# EAGLE design co2-sensor (EAGLE 9.2.2)
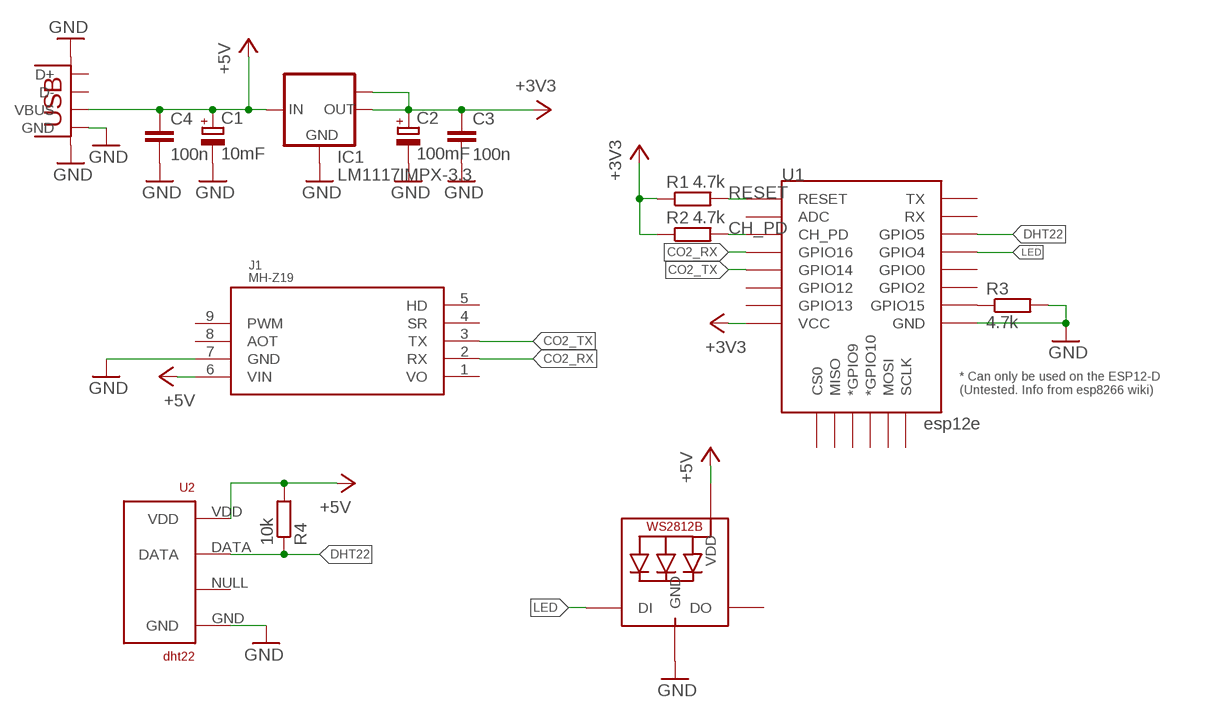
[diagram p0: schematic, sheet 1]

## Parts
C1  10mF  CPOL-EUCT3216  [CT3216]
C2  100mF  CPOL-EUCT3216  [CT3216]
C3  100n  C-EUC0805  [C0805]
C4  100n  C-EUC0805  [C0805]
IC1  LM1117IMPX-3.3  [SOT223]
J1  MH-Z19  [MH-Z19-REV]
LED1  WS2812B_5050N  [WS2812B-NARROW]
R1  4.7k  R-EU_M0805  [M0805]
R2  4.7k  R-EU_M0805  [M0805]
R3  4.7k  R-EU_M0805  [M0805]
R4  10k  R-EU_M0805  [M0805]
U1  esp12e  ESP12ESMD  [ESP12E-SMD]
U2  dht22  RHT03_DHT-22_AM2302WIRED  [AM2302]
U$1  USB-A  [USB-A-SMT]

## Nets
+3V3 [+3.3V]: C2.+ C3.1 IC1.2(OUT) IC1.TAB(OUT1) R1.1 R2.1 U1.VCC
+5V [+5V]: C1.+ C4.1 IC1.3(IN) J1.6(VIN) LED1.1-VDD(VDD) R4.2 U2.VDD U$1.P$6(VBUS)
CH_PD: R2.2 U1.CH_PD
CO2_RX: J1.2(RX) U1.GPIO16
CO2_TX: J1.3(TX) U1.GPIO14
DHT22: R4.1 U1.GPIO5 U2.DATA
GND [GND]: C1.- C2.- C3.2 C4.2 IC1.1(GND) J1.7(GND) LED1.3-GND(GND) R3.2 U1.GND U2.GND U$1.P$1(GND) U$1.P$2(GND) U$1.P$3(GND)
LED: LED1.4-DIN(DI) U1.GPIO4
N$1: R3.1 U1.GPIO15
RESET: R1.2 U1.RESET
Unconnected: J1.4(SR) J1.5(HD) J1.8(AOT) J1.9(PWM) LED1.2-DOUT(DO) U1.ADC U1.CS0 U1.GPIO0 U1.GPIO2 U1.GPIO9(*GPIO9) U1.GPIO10(*GPIO10) U1.GPIO12 U1.GPIO13 U1.MISO U1.MOSI U1.RXD0(RX) U1.SCLK U1.TXD0(TX) U2.NULL U$1.P$4(D+) U$1.P$5(D-)

## Power pins joined to a net without a drawn wire
VO: J1.1(VO)

## Library data of the parts
C1 C2 = rcl:CPOL-EU: POLARIZED CAPACITOR, European symbol; SPICEPREFIX: C
C3 C4 = rcl:C-EU: CAPACITOR, European symbol; SPICEPREFIX: C
IC1 = lm1117:LM1117IMPX-*
J1 = mh-z19:MH-Z19: MH-Z19 - CO2 NDIR SENSOR
LED1 = WS2812B:WS2812B; AVAILABILITY: Unavailable; DESCRIPTION: Intelligent Control Led Integrated Light Source Pack Of 10; MF: Worldsemi; MP: WS2812B; PACKAGE: None; PRICE: None
R1-R4 = rcl:R-EU_: RESISTOR, European symbol; SPICEPREFIX: R
U1 = esp8266modules:ESP12E: ESP12E Module
U2 = RHT03_DHT-22_AM2302:RHT03_DHT-22_AM2302: RHT03 / DHT-22 / AM2302 Packages and symbol for the RHT03 / DHT-22 relative humidity and temperature sensor. Note: The AM2302 is a wired version of the DHT-22 which typically requires less clearance and is thus provided as a separate package.; PROD_ID: SEN-10167
U$1 = usb:USB-A: USB 2.0 4Pin A Type Male Plug SMT Connector

## Net classes
0 default: width 0.4 mm, clearance 0.205 mm
1 GND: width 1 mm, clearance 0.205 mm to class 0, clearance 0.205 mm
2 +5V: width 0.8 mm, clearance 0.205 mm to class 0, clearance 0.205 mm to class 1, clearance 0.205 mm
3 +3.3V: width 0.8 mm, clearance 0.205 mm to class 0, clearance 0.205 mm to class 1, clearance 0.205 mm to class 2, clearance 0.205 mm

## Board
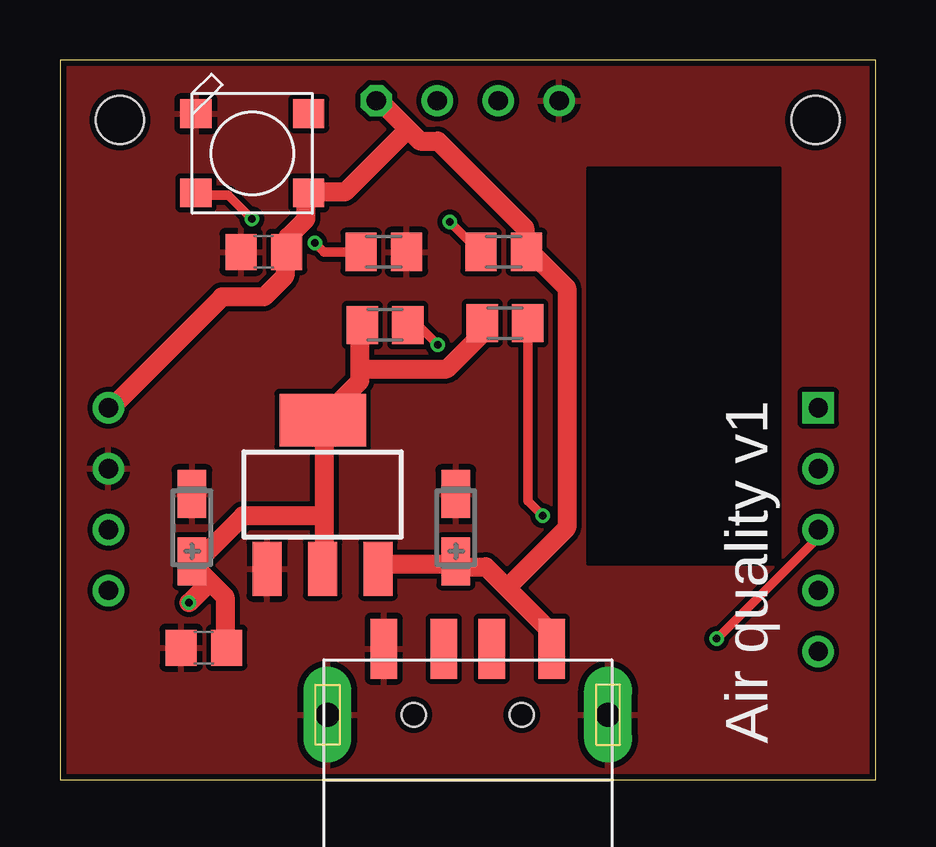
[diagram p1: board, top side]
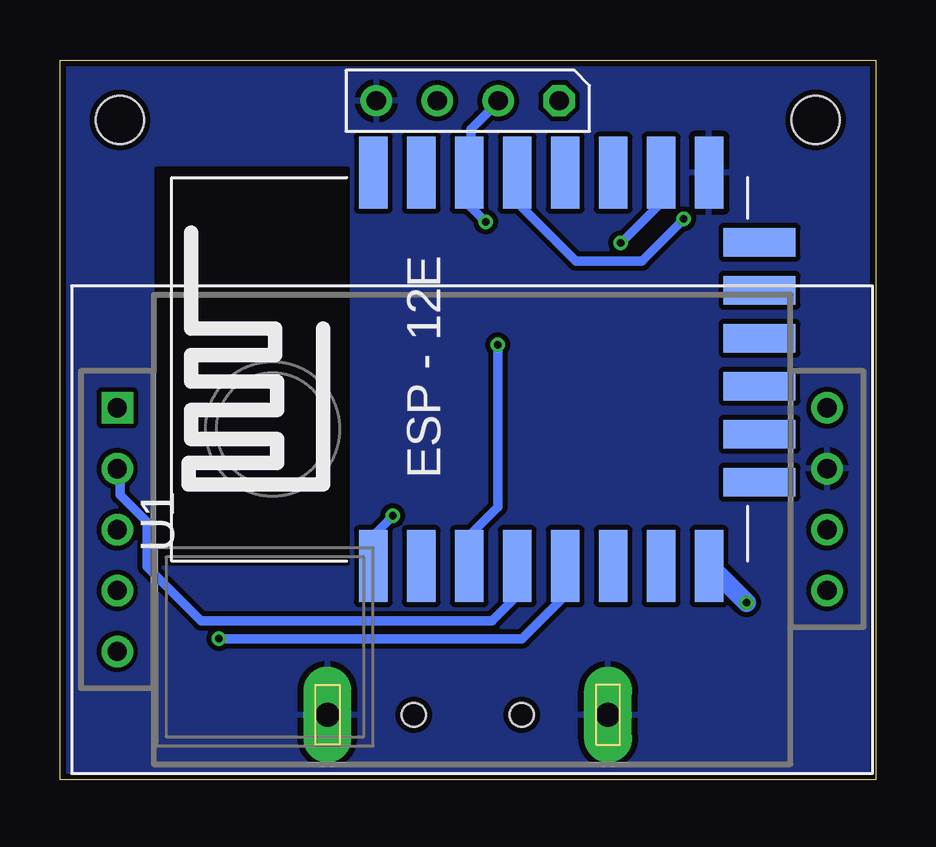
[diagram p2: board, bottom side, seen from below]

Size 34 x 30 mm. Coordinates in mm from the lower left corner, seen from the top.
Outline: 0,0 34,0 34,30 0,30 0,0
Copper layers (1*16): Top 0.035mm / dielectric 1.5mm / Bottom 0.035mm
Design rules "co2-sensor": minimum track width 6mil, minimum drill 12mil, track to track 0.205mm, track to pad 0.205mm, pad to pad 0.205mm, via to via 0.205mm, smd to smd 0mil, copper to edge 10mil, drill to drill 10mil, minimum pad ring 10mil, minimum via ring 6mil, stop-mask expansion 2mil, vias tented up to drill 100mil, thermal gap 10mil
Holes 2 mm at 2.5,27.5 31.5,27.5
tRestrict: area 22,9 to 30,25.5
bRestrict: area 22,9 to 30,25.5

### Footprints (pad centres in the part's own frame; a part is rotated, then mirrored left to right if it is on the bottom)
CT3216 = smd 2 x 1.2: + -1.4,0; - 1.4,0
C0805 = smd 1.3 x 1.5: 1 -0.95,0; 2 0.95,0
SOT223 = smd 1.219 x 2.235: 1 -2.311,-3.099; 2 0,-3.099; 3 2.311,-3.099 | smd 3.6 x 2.2: TAB 0,3.099
MH-Z19-REV = drill 0.8 square: 1 9.779,-13.97 | drill 0.8: 2 9.779,-11.43; 3 9.779,-8.89; 4 9.779,-6.35; 5 9.779,-3.81; 6 39.37,-13.97; 7 39.37,-11.43; 8 39.37,-8.89; 9 39.37,-6.35
WS2812B-NARROW = smd 1.3 x 1.2: 1-VDD 2.35,-1.65; 2-DOUT 2.35,1.65; 3-GND -2.35,1.65; 4-DIN -2.35,-1.65
M0805 = smd 1.3 x 1.6: 1 -0.95,0; 2 0.95,0
ESP12E-SMD = smd 3 x 1.2: ADC -8.3,3.8; CH_PD -8.3,1.8; GND 8.1,-8.2; GPIO0 8.1,-2.2; GPIO2 8.1,-4.2; GPIO4 8.1,-0.2; GPIO5 8.1,1.8; GPIO12 -8.3,-4.2; GPIO13 -8.3,-6.2; GPIO14 -8.3,-2.2; GPIO15 8.1,-6.2; GPIO16 -8.3,-0.2; RESET -8.3,5.8; RXD0 8.1,3.8; TXD0 8.1,5.8; VCC -8.3,-8.2 | smd 1.2 x 3: CS0 -4.8,-10.3; GPIO9 -0.8,-10.3; GPIO10 1.2,-10.3; MISO -2.8,-10.3; MOSI 3.2,-10.3; SCLK 5.2,-10.3
AM2302 = drill 0.8: DATA -1.27,0; GND 3.81,0; NULL 1.27,0 | drill 0.8 octagon: VDD -3.81,0
USB-A-SMT = drill 1 pad 2 long: P$1 -5.85,2.7; P$2 5.85,2.7 | smd 1.1 x 2.5: P$3 -3.5,5.45; P$4 -1,5.45; P$5 1,5.45; P$6 3.5,5.45 | hole 1: -2.25,2.7; 2.25,2.7

### Placement (x,y rotation side)
C1  16.5,10.5 90 top
C2  5.5,10.5 90 top
C3  6,5.5 180 top
C4  8.5,22 180 top
IC1  10.95,11.88 0 top
J1  41.39,1.53 180 top
LED1  8.02,26.11 0 top
R1  18.55,19.03 0 top
R2  13.55,18.95 0 top
R3  13.5,22 0 top
R4  18.5,22 0 top
U1  15.14,17.2 90 bottom
U2  17,28.3 180 bottom
U$1  17,0 0 top

### Tracks (layer width: path | path; a pad name or v marks a point on that pad's centre or on a via)
+3V3  (via drill 0.3)
  Top 0.8: 6.25,8.25 5.5,9 C2.+ 5.88,9.25 7.62,11 11,11 | 6.25,8.25 6.88,7.62 6.88,5.5 C3.1 | 6.25,8.25 v5.38,7.38 | 12.5,17.12 12.5,16.62 10.88,15 IC1.TAB 11,14.62 11,11 | 12.5,17.12 12.5,18.88 R2.1 | 12.5,17.12 16.12,17.12 17.5,18.5 17.5,19 R1.1 | 11,11 11,8.88 IC1.2
  Bottom 0.8: v5.38,7.38 6.88,8.88 U1.VCC
+5V
  Top 0.8: IC1.3 13.25,8.88 13.38,9 16.5,9 C1.+ 16.88,8.88 17.75,8.88 18.62,8 | U$1.P$6 20.5,6.12 18.62,8 | 14.5,27.12 13.25,28.38 U2.VDD | 14.5,27.12 15,26.62 15.75,26.62 19.38,23 19.38,22 R4.2 19.75,21.88 21.12,20.5 21.12,10.5 18.62,8 | 14.5,27.12 11.88,24.5 10.75,24.5 LED1.1-VDD 10.25,24.38 10.25,23.38 9.5,22.62 9.5,22 C4.1 9.38,21.62 9.38,21 8.5,20.12 6.75,20.12 2.12,15.5 J1.6
CH_PD  (via drill 0.3)
  Top 0.4: v15.75,18.12 15,18.88 14.5,18.88 R2.2
  Bottom 0.4: v15.75,18.12 15.75,11.38 16.88,10.25 16.88,9 U1.CH_PD
CO2_RX
  Bottom 0.4: J1.2 31.5,12.88 31.5,11.88 30.38,10.75 30.38,8.88 28.12,6.62 16,6.62 15,7.62 15,8.88 U1.GPIO16
CO2_TX  (via drill 0.3)
  Top 0.4: v27.38,5.88 31.5,10 31.5,10.38 J1.3
  Bottom 0.4: v27.38,5.88 14.75,5.88 13,7.62 13,8.88 U1.GPIO14
DHT22  (via drill 0.3)
  Top 0.4: v16.25,23.25 17.5,22 R4.1
  Bottom 0.4: v16.25,23.25 16.88,23.88 16.88,25.25 U1.GPIO5 16.88,25.5 16.88,27.12 15.75,28.25 U2.DATA
GND
  pour Bottom: 0,30 34,30 34,0 0,0
  pour Top: 0,30 34,30 34,0 0,0
LED  (via drill 0.3)
  Top 0.4: v8,23.38 7,24.38 5.75,24.38 LED1.4-DIN
  Bottom 0.4: v8,23.38 9.75,21.62 12.5,21.62 14.88,24 14.88,25.25 U1.GPIO4
N$1  (via drill 0.3)
  Top 0.4: R3.1 11,22 v10.62,22.38
  Bottom 0.4: v10.62,22.38 9,24 9,25.25 U1.GPIO15
RESET  (via drill 0.3)
  Top 0.4: R1.2 19.5,11.62 v20.12,11
  Bottom 0.4: v20.12,11 20.88,10.25 20.88,9 U1.RESET

### Text on the board
tNames: Air quality v1